# Altium schematic sheet Sheet1.SchDoc
size A3
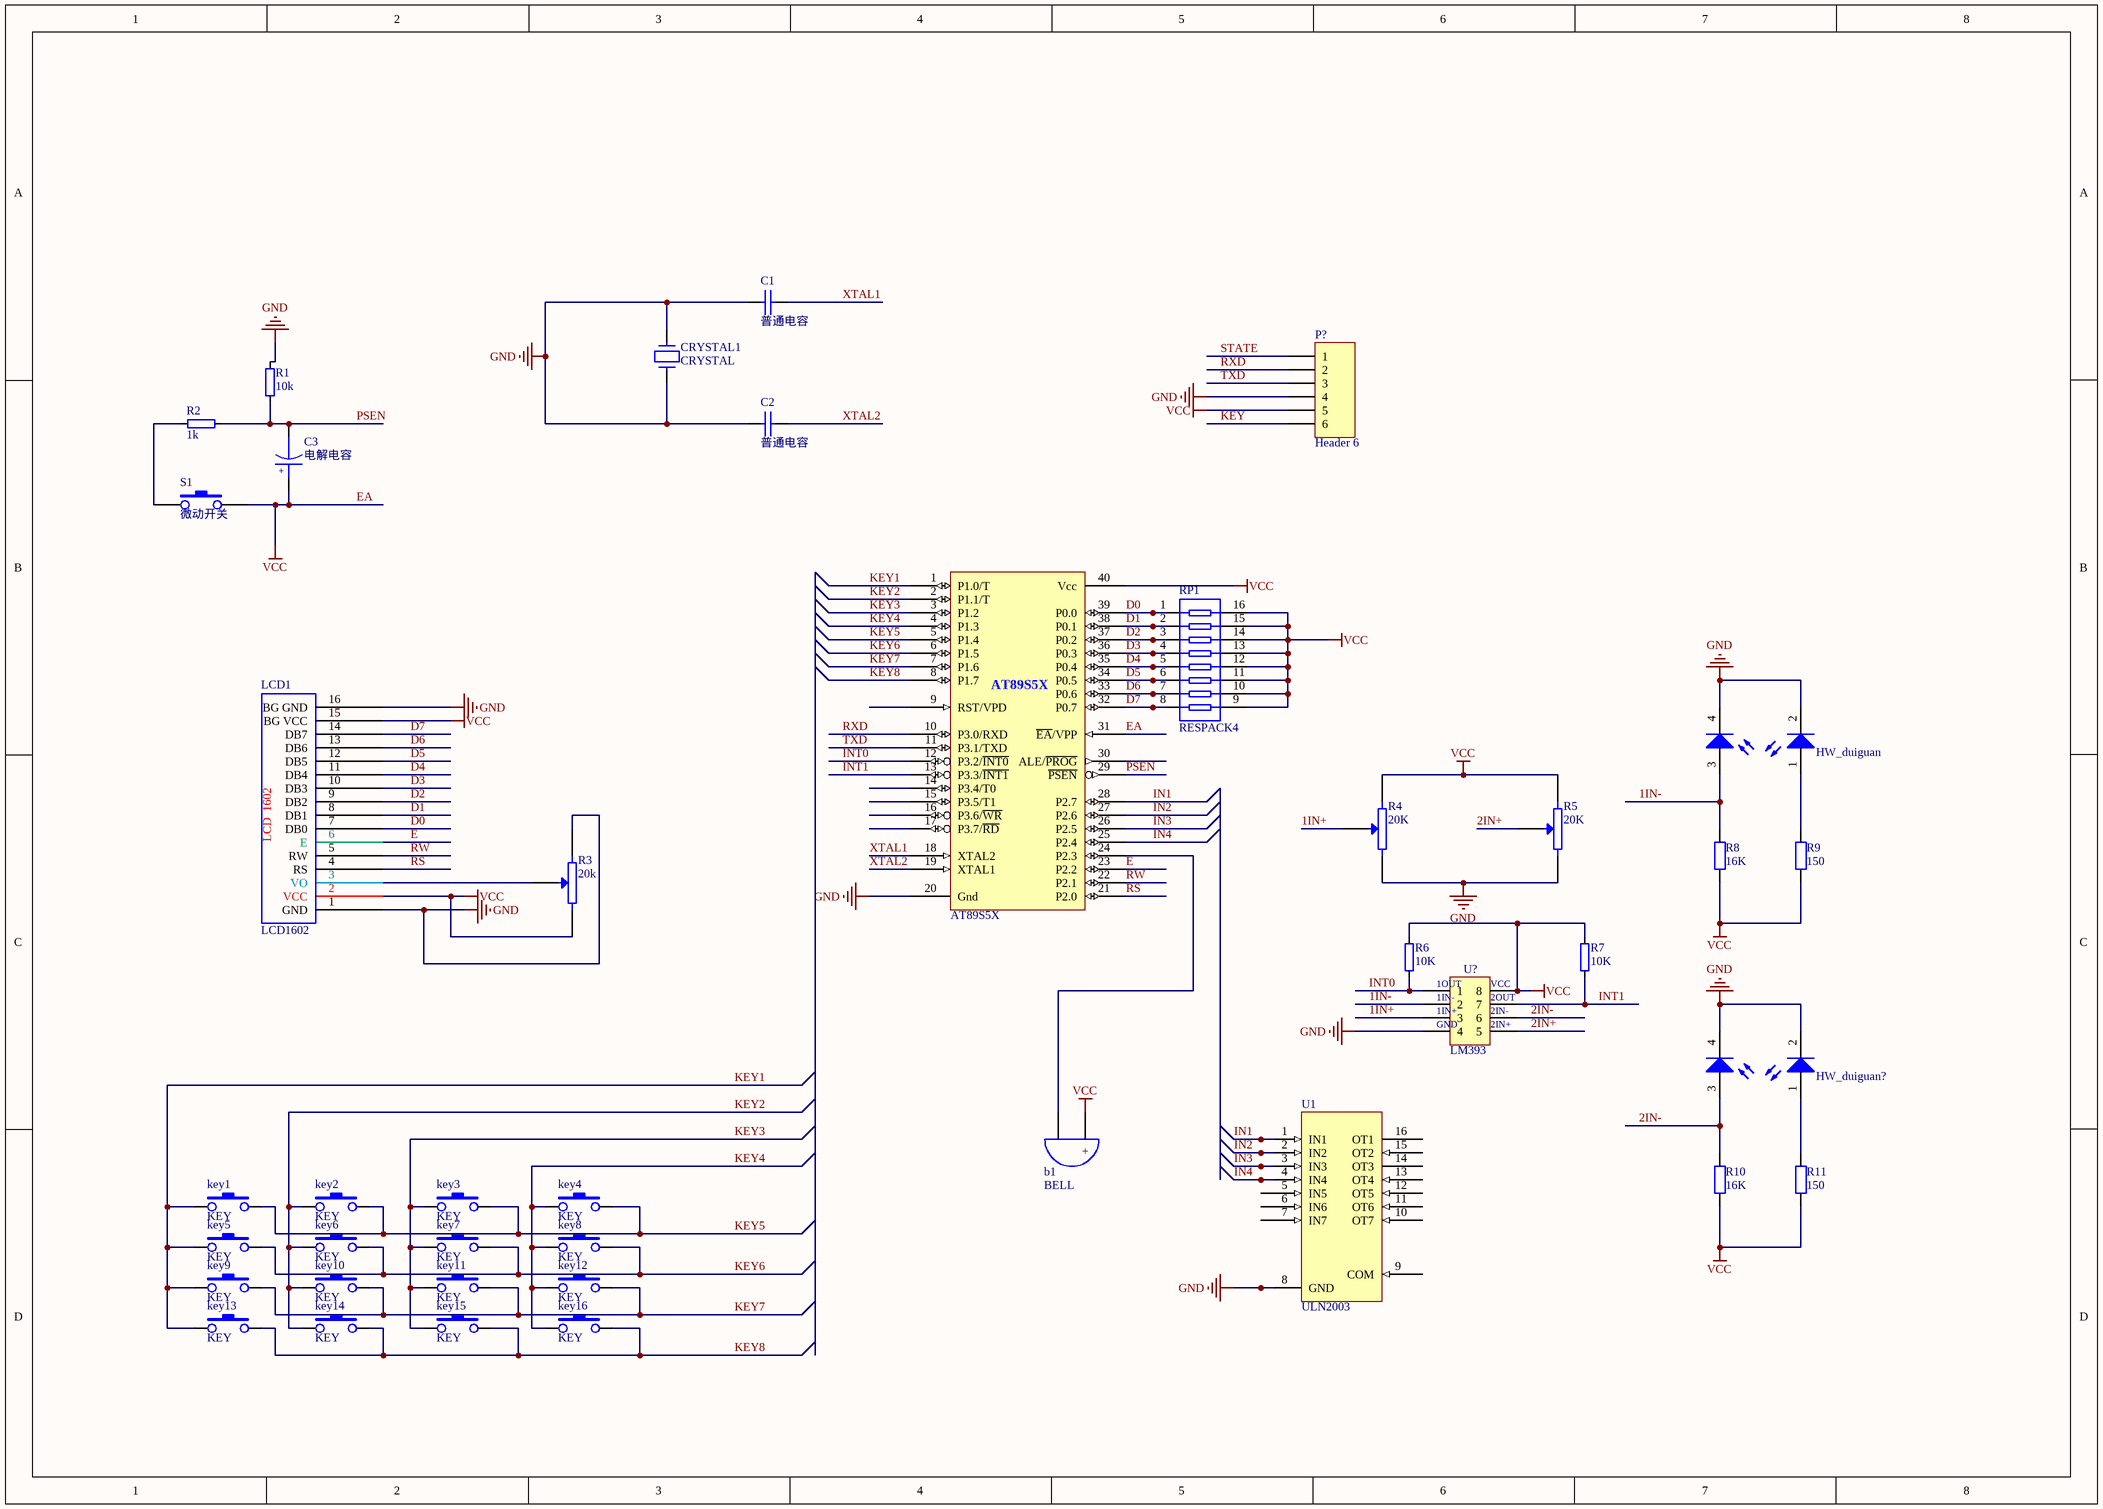
[diagram p0: Sheet1.SchDoc]

## Parts
?  AT89S5X  [DIP40 - narrow]
b1  BELL  [BELL]
C1  普通电容  [CC3216-1206]
C2  普通电容  [CC3216-1206]
C3  电解电容  [CAPPR2-5X5]
CRYSTAL1  CRYSTAL  [XTAL]
HW_duiguan  L_HW*2  [AN66]  (value not drawn)
HW_duiguan?  L_HW*2  [AN66]  (value not drawn)
key1  KEY  [AN12]
key2  KEY  [AN12]
key3  KEY  [AN12]
key4  KEY  [AN12]
key5  KEY  [AN12]
key6  KEY  [AN12]
key7  KEY  [AN12]
key8  KEY  [AN12]
key9  KEY  [AN12]
key10  KEY  [AN12]
key11  KEY  [AN12]
key12  KEY  [AN12]
key13  KEY  [AN12]
key14  KEY  [AN12]
key15  KEY  [AN12]
key16  KEY  [AN12]
LCD1  LCD1602  [1602LCD]
P?  Header 6  [HDR1X6]
R1  10k  [AXIAL0.3]
R2  1k  [AXIAL0.3]
R3  20k  [VR]
R4  20K  [VR]
R5  20K  [VR]
R6  10K  [AXIAL0.3]
R7  10K  [AXIAL0.3]
R8  value 16K  [AXIAL-0.4]  (hidden comment: Res2)
R9  value 150  [AXIAL-0.4]  (hidden comment: Res2)
R10  value 16K  [AXIAL-0.4]  (hidden comment: Res2)
R11  value 150  [AXIAL-0.4]  (hidden comment: Res2)
RP1  RESPACK4  [SIP8]
S1  微动开关  [AN12]
U1  ULN2003  [DIP16]
U?  LM393  [DIP8]

## Nets
EA: ?.31(~{EA}/VPP) ?.40(Vcc) b1.1(+) C3.1 LCD1.2(VCC) LCD1.15(BG_VCC) P?.5 R3.1 R4.2 R5.2 R6.2 R7.2 R8.2 R9.2 R10.2 R11.2 RP1.9 RP1.10 RP1.11 RP1.12 RP1.13 RP1.14 RP1.15 RP1.16 S1.2 U?.8  [also labelled VCC]
GND: ?.20(Gnd) C1.1 C2.1 CRYSTAL1.1 CRYSTAL1.2 HW_duiguan.2 HW_duiguan.4 HW_duiguan?.2 HW_duiguan?.4 LCD1.1(GND) LCD1.16(BG_GND) P?.4 R1.1 R3.2 R4.1 R5.1 U1.8(GND) U?.4
1IN+: R4.3(w) U?.3
1IN-: HW_duiguan.3 R8.1 U?.2
2IN+: R5.3(w) U?.5
2IN-: HW_duiguan?.3 R10.1 U?.6
D0: ?.39(P0.0) LCD1.7(DB0) RP1.1
D1: ?.38(P0.1) LCD1.8(DB1) RP1.2
D2: ?.37(P0.2) LCD1.9(DB2) RP1.3
D3: ?.36(P0.3) LCD1.10(DB3) RP1.4
D4: ?.35(P0.4) LCD1.11(DB4) RP1.5
D5: ?.34(P0.5) LCD1.12(DB5) RP1.6
D6: ?.33(P0.6) LCD1.13(DB6) RP1.7
D7: ?.32(P0.7) LCD1.14(DB7) RP1.8
E: ?.23(P2.2) LCD1.6(E)
IN1: ?.28(P2.7) U1.1(IN1)
IN2: ?.27(P2.6) U1.2(IN2)
IN3: ?.26(P2.5) U1.3(IN3)
IN4: ?.25(P2.4) U1.4(IN4)
INT0: ?.12(P3.2/~{INT0}) R6.1 U?.1
INT1: ?.13(P3.3/~{INT1}) R7.1 U?.7
KEY: P?.6
KEY1: ?.1(P1.0/T) key1.1 key5.1 key9.1 key13.1
KEY2: ?.2(P1.1/T) key2.1 key6.1 key10.1 key14.1
KEY3: ?.3(P1.2) key3.1 key7.1 key11.1 key15.1
KEY4: ?.4(P1.3) key4.1 key8.1 key12.1 key16.1
KEY5: ?.5(P1.4) key1.2 key2.2 key3.2 key4.2
KEY6: ?.6(P1.5) key5.2 key6.2 key7.2 key8.2
KEY7: ?.7(P1.6) key9.2 key10.2 key11.2 key12.2
KEY8: ?.8(P1.7) key13.2 key14.2 key15.2 key16.2
PSEN: ?.29(~{PSEN}) C3.2 R1.2 R2.2
RS: ?.21(P2.0) LCD1.4(RS)
RW: ?.22(P2.1) LCD1.5(RW)
RXD: ?.10(P3.0/RXD) P?.2
STATE: P?.1
TXD: ?.11(P3.1/TXD) P?.3
XTAL1: ?.18(XTAL2) C1.2
XTAL2: ?.19(XTAL1) C2.2
Net?_24: ?.24(P2.3) b1.2
NetHW_duiguan?_1: HW_duiguan?.1 R11.1
NetHW_duiguan_1: HW_duiguan.1 R9.1
NetLCD1_3: LCD1.3(VO) R3.3(w)
NetR2_1: R2.1 S1.1

Not connected (* = marked no-connect by the designer): ? 9(RST/VPD) 14(P3.4/T0) 15(P3.5/T1) 16(P3.6/~{WR}) 17(P3.7/~{RD}) 30(ALE/~{PROG}); U1 5(IN5) 6(IN6) 7(IN7) 9(COM) 10(OT7) 11(OT6) 12(OT5) 13(OT4) 14(OT3) 15(OT2) 16(OT1)

## Notes on the sheet
- (in symbol LCD1602) LCD  1602
- (in symbol LM393) 1OUT; VCC; 1IN-; 2OUT; 1IN+; 2IN-; GND; 2IN+
- (in symbol 电解电容) +

## Library data of the parts
C1 C2 = 普通电容: Capacitor
C3 = 电解电容: Capacitor
P? = Header 6: Header, 6-Pin; LatestRevisionDate: 17-Jul-2002; LatestRevisionNote: Re-released for DXP Platform.; Publisher: Altium Limited
R1 R2 R6 R7 = RES
R3-R5 = RESVR: Potentiometer
R8-R11 = Res2: Resistor; Published: 8-Jun-2000; LatestRevisionDate: 17-Jul-2002; LatestRevisionNote: Re-released for DXP Platform.; PackageReference: AXIAL-0.4; Publisher: Altium Limited